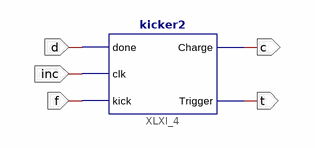
[diagram p0: schematic sheet 1]
// Xilinx ISE schematic kickertest.sch (spartan6) as structural Verilog: 1 symbols, 5 ports
module kickertest (
  input  inc,
  input  d,
  input  f,
  output c,
  output t
);

  kicker2 XLXI_4 (.done(d), .clk(inc), .kick(f), .Charge(c), .Trigger(t));
endmodule
